# EAGLE design Arduino_Eth08d_MU-REV3 (EAGLE 6.4)
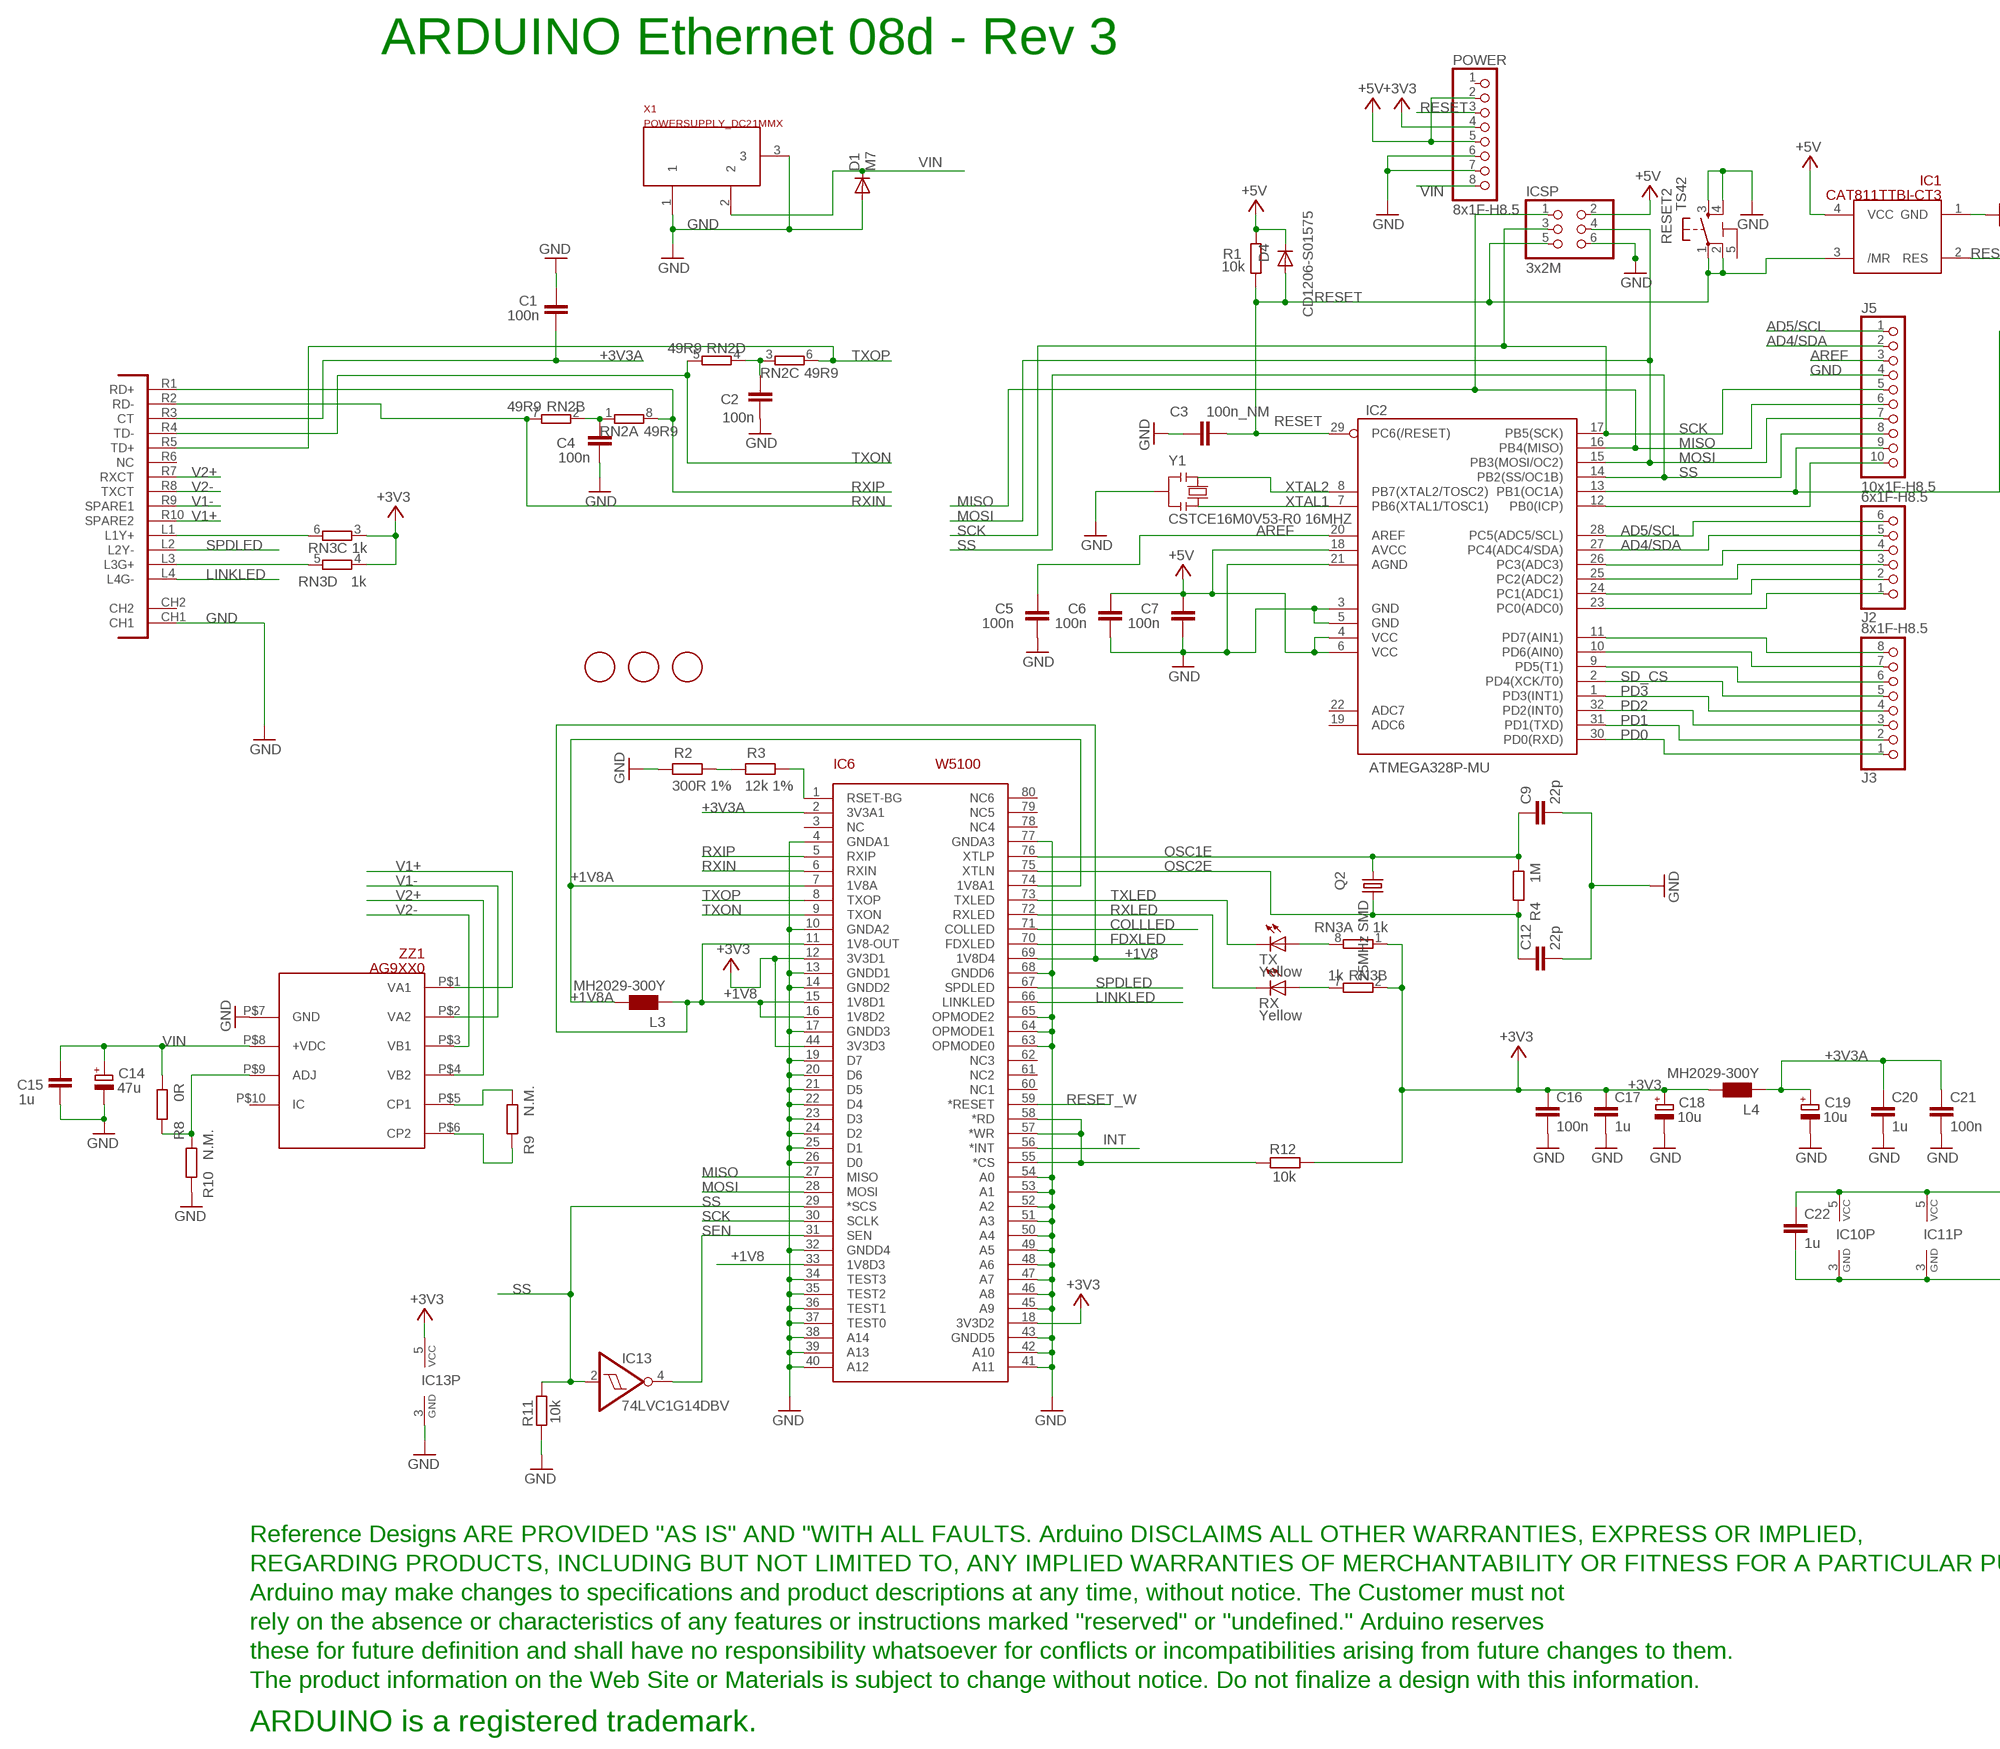
[diagram p0: schematic, sheet 1, part 1 of 2]
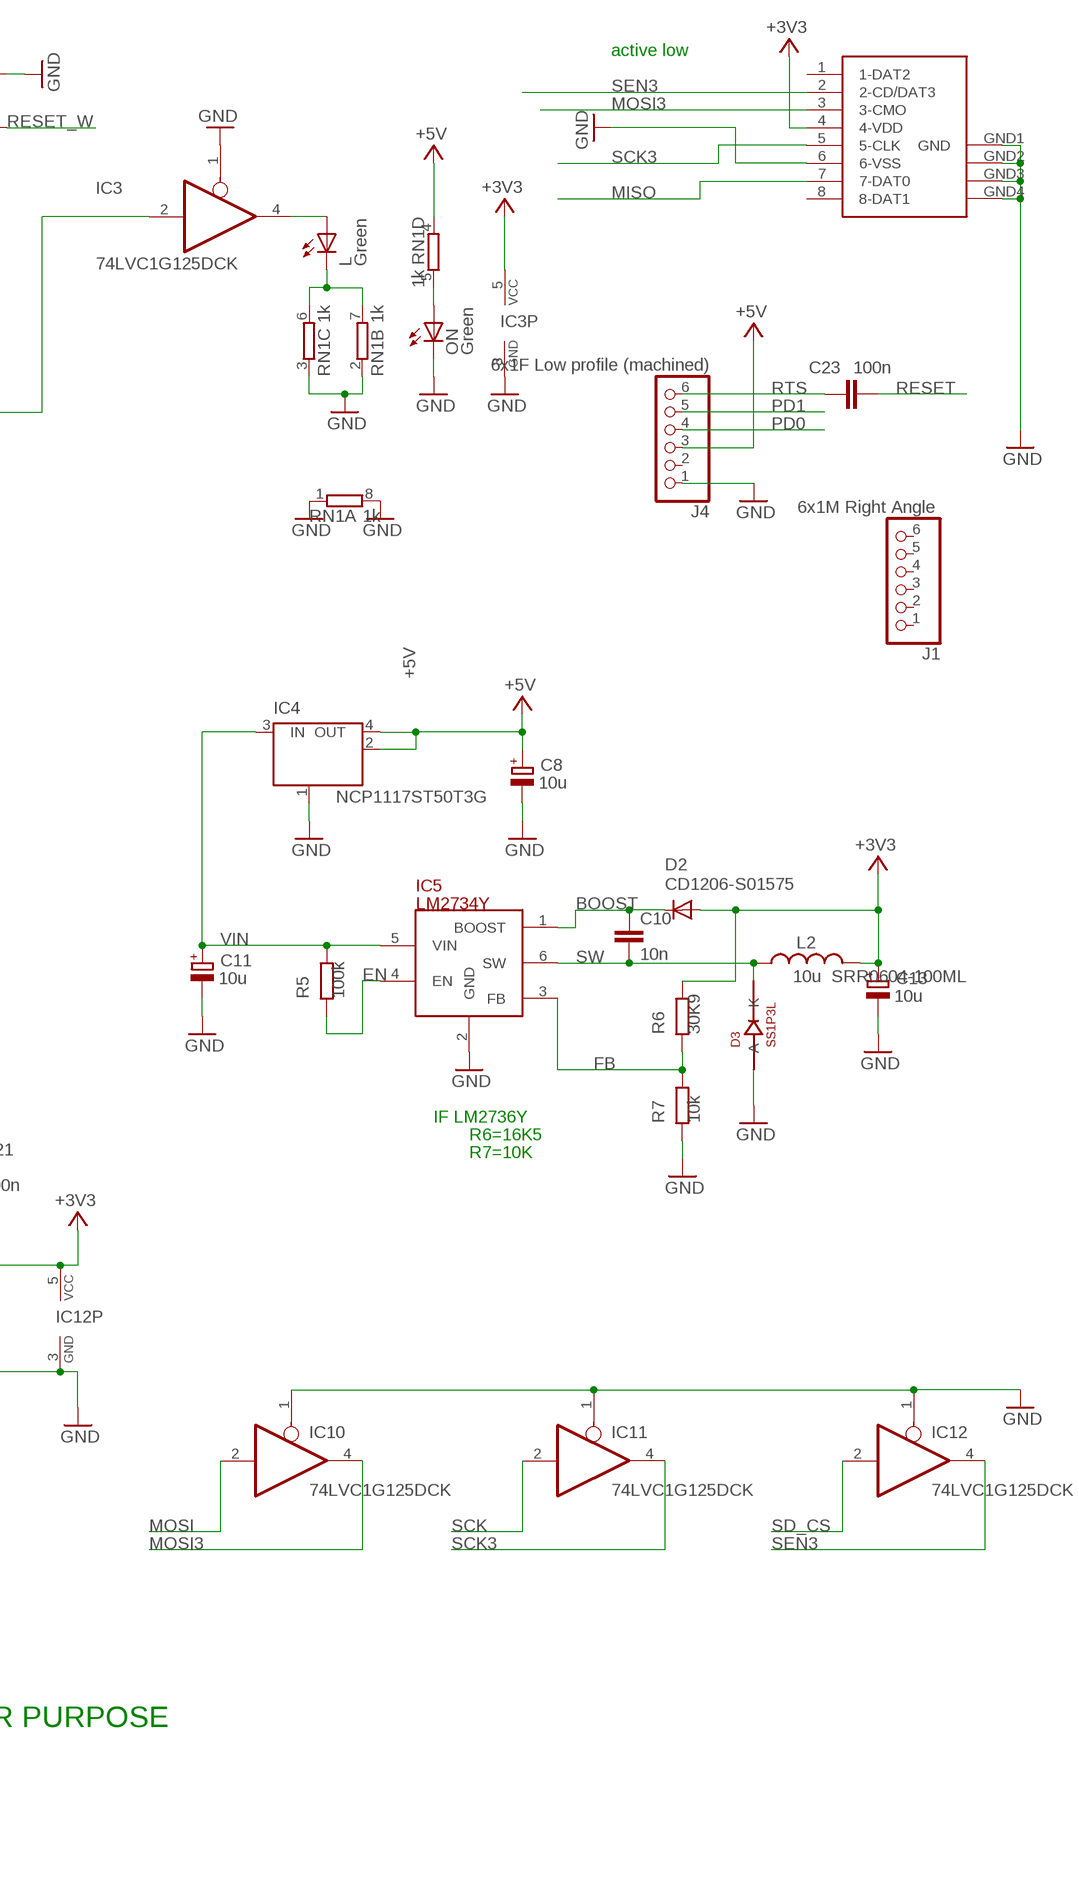
[diagram p1: schematic, sheet 1, part 2 of 2]

## Parts
C1  100n  C-EUC0603  [C0603-ROUND]
C2  100n  C-EUC0603  [C0603-ROUND]
C3  100n_NM  C-EUC0603  [C0603-ROUND]
C4  100n  C-EUC0603  [C0603-ROUND]
C5  100n  C-EUC0603  [C0603-ROUND]
C6  100n  C-EUC0603  [C0603-ROUND]
C7  100n  C-EUC0603  [C0603-ROUND]
C8  10u  CPOL-EUSMCB  [SMC_B]
C9  22p  C-EUC0603  [C0603-ROUND]
C10  10n  C-EUC0603  [C0603-ROUND]
C11  10u  CPOL-EUSMCB  [SMC_B]
C12  22p  C-EUC0603  [C0603-ROUND]
C13  10u  CPOL-EUSMCB  [SMC_B]
C14  47u  CPOL-EUD  [PANASONIC_D]
C15  1u  C-EUC0603  [C0603-ROUND]
C16  100n  C-EUC0603  [C0603-ROUND]
C17  1u  C-EUC0603  [C0603-ROUND]
C18  10u  CPOL-EUSMCB  [SMC_B]
C19  10u  CPOL-EUSMCB  [SMC_B]
C20  1u  C-EUC0603  [C0603-ROUND]
C21  100n  C-EUC0603  [C0603-ROUND]
C22  1u  C-EUC0603  [C0603-ROUND]
C23  100n  C-EUC0603  [C0603-ROUND]
D1  M7  DIODE-SMB  [SMB]
D2  CD1206-S01575  DIODE-MINIMELF  [MINIMELF]
D3  SS1P3L  [DO220AAL]
D4  CD1206-S01575  DIODE-MINIMELF  [MINIMELF]
FD1  FIDUCIALMOUNT  [FIDUCIA-MOUNT]
FD2  FIDUCIALMOUNT  [FIDUCIA-MOUNT]
FD3  FIDUCIALMOUNT  [FIDUCIA-MOUNT]
IC1  CAT811TTBI-CT3  STM812  [SOT143]
IC2  ATMEGA328P-MU  ATMEGAXX8-MUR  [MLF32]
IC3  74LVC1G125DCK  [SC70-5]
IC4  NCP1117ST50T3G  LINEAR_MC33269ST  [LINEAR_SOT223]
IC5  LM2734Y  LM2736Y  [SOT23-6]
IC6  W5100  [SQFP-S-10X10-80]
IC10  74LVC1G125DCK  [SC70-5]
IC11  74LVC1G125DCK  [SC70-5]
IC12  74LVC1G125DCK  [SC70-5]
IC13  74LVC1G14DBV  [SOT23-5]
ICSP  3x2M  PINHD-2X3  [2X03]
J1  6x1M Right Angle  PINHD-1X6/90  [1X06/90]
J2  6x1F-H8.5  PINHD-1X6  [1X06]
J3  8x1F-H8.5  PINHD-1X8  [1X08]
J4  6x1F Low profile (machined)  PINHD-1X6TH  [1X06-TH]
J5  10x1F-H8.5  PINHD-1X10  [1X10]
L  Green  LEDCHIPLED_0805  [CHIPLED_0805]
L2  10u SRR0604-100ML  L-USSRR0604  [SRR0604]
L3  MH2029-300Y  WE-CBF_0805  [0805]
L4  MH2029-300Y  WE-CBF_0805  [0805]
ON  Green  LEDCHIPLED_0805  [CHIPLED_0805]
POWER  8x1F-H8.5  PINHD-1X8  [1X08]
Q2  25MHz SMD  CRYSTALHC49UP  [HC49UP]
R1  10k  R-EU_0603-RND  [R0603-ROUND]
R2  300R 1%  R-EU_0603-RND  [R0603-ROUND]
R3  12k 1%  R-EU_0603-RND  [R0603-ROUND]
R4  1M  R-EU_0603-RND  [R0603-ROUND]
R5  100k  R-EU_0603-RND  [R0603-ROUND]
R6  30K9  R-EU_0603-RND  [R0603-ROUND]
R7  10k  R-EU_0603-RND  [R0603-ROUND]
R8  0R  R-EU_0603-RND  [R0603-ROUND]
R9  N.M.  R-EU_0603-RND  [R0603-ROUND]
R10  N.M.  R-EU_0603-RND  [R0603-ROUND]
R11  10k  R-EU_0603-RND  [R0603-ROUND]
R12  10k  R-EU_R0603  [R0603-ROUND]
RESET2  TS42  [TS42]
RN1  1k  4R-NCAY16  [CAY16]
RN2  49R9  4R-NCAY16  [CAY16]
RN3  1k  4R-NCAY16  [CAY16]
RX  Yellow  LEDCHIPLED_0805  [CHIPLED_0805]
TX  Yellow  LEDCHIPLED_0805  [CHIPLED_0805]
U$1  POE-RJ45  [POE-RJ45]
U$2  DISCLAIMER  [DISCLAIMER]
X1  POWERSUPPLY_DC21MMX  [POWERSUPPLY_DC-21MM]
X2  SDCARD-15TW-8821  [SDCARD-15TW-8821]
Y1  CSTCE16M0V53-R0 16MHZ  RESONATORMU  [RESONATOR]
ZZ1  AG9XX0  [AG9000]

## Nets
+1V8 [power]: IC6.11(1V8-OUT) IC6.15(1V8D1) IC6.16(1V8D2) IC6.33(1V8D3) IC6.69(1V8D4) L3.1
+1V8A [power]: IC6.7(1V8A) IC6.74(1V8A1) L3.2
+3V3 [power]: C13.+ C16.1 C17.1 C18.+ C22.1 D2.A IC3.5(VCC) IC6.12(3V3D1) IC6.18(3V3D2) IC6.44(3V3D3) IC10.5(VCC) IC11.5(VCC) IC12.5(VCC) IC13.5(VCC) L2.P$2 L4.2 POWER.4 R6.1 R12.2 RN3.1 RN3.2 RN3.3 RN3.4 X2.4(4-VDD)
+3V3A [power]: C1.1 C19.+ C20.1 C21.1 IC6.2(3V3A1) L4.1 U$1.R3(CT)
+5V [power]: C6.1 C7.1 C8.+ D4.C IC1.4(VCC) IC2.4(VCC) IC2.6(VCC) IC2.18(AVCC) IC4.2(OUT) IC4.4(OUT) ICSP.2 J4.3 POWER.2 POWER.5 R1.2 RN1.4
AD4/SDA: IC2.27(PC4(ADC4/SDA)) J2.5 J5.2
AD5/SCL: IC2.28(PC5(ADC5/SCL)) J2.6 J5.1
AREF: C5.1 IC2.20(AREF) J5.3
BOOST: C10.1 D2.C IC5.1(BOOST)
COLLLED: IC6.71(COLLED)
EN: IC5.4(EN) R5.2
FB: IC5.3(FB) R6.2 R7.1
FDXLED: IC6.70(FDXLED)
GND [power]: C1.2 C2.1 C3.2 C4.1 C5.2 C6.2 C7.2 C8.- C9.2 C11.- C12.2 C13.- C14.- C15.1 C16.2 C17.2 C18.- C19.- C20.2 C21.2 C22.2 D1.A D3.P$2(A) IC1.1(GND) IC2.3(GND) IC2.5(GND) IC2.21(AGND) IC3.1(OE) IC3.3(GND) IC4.1(GND/ADJ) IC5.2(GND) IC6.4(GNDA1) IC6.10(GNDA2) IC6.13(GNDD1) IC6.14(GNDD2) IC6.17(GNDD3) IC6.19(D7) IC6.20(D6) IC6.21(D5) IC6.22(D4) IC6.23(D3) IC6.24(D2) IC6.25(D1) IC6.26(D0) IC6.32(GNDD4) IC6.34(TEST3) IC6.35(TEST2) IC6.36(TEST1) IC6.37(TEST0) IC6.38(A14) IC6.39(A13) IC6.40(A12) IC6.41(A11) IC6.42(A10) IC6.43(GNDD5) IC6.45(A9) IC6.46(A8) IC6.47(A7) IC6.48(A6) IC6.49(A5) IC6.50(A4) IC6.51(A3) IC6.52(A2) IC6.53(A1) IC6.54(A0) IC6.63(OPMODE0) IC6.64(OPMODE1) IC6.65(OPMODE2) IC6.68(GNDD6) IC6.77(GNDA3) IC10.1(OE) IC10.3(GND) IC11.1(OE) IC11.3(GND) IC12.1(OE) IC12.3(GND) IC13.3(GND) ICSP.6 J4.1 J5.4 ON.C POWER.6 POWER.7 R2.2 R7.2 R10.2 R11.1 RESET2.3 RESET2.4 RN1.1 RN1.2 RN1.3 RN1.8 U$1.CH1 X1.1 X1.3 X2.6(6-VSS) X2.GND1(GND) X2.GND2(GND1) X2.GND3(GND2) X2.GND4(GND3) Y1.2 ZZ1.P$7(GND)
INT: IC6.56(*INT)
LINKLED: IC6.66(LINKLED) U$1.L4(L4G-)
MISO: IC2.16(PB4(MISO)) IC6.27(MISO) ICSP.1 J5.6 X2.7(7-DAT0)
MOSI: IC2.15(PB3(MOSI/OC2)) IC6.28(MOSI) IC10.2(I) ICSP.4 J5.7
MOSI3: IC10.4(O) X2.3(3-CMO)
N$1: IC3.4(O) L.A
N$2: RN3.5 U$1.L3(L3G+)
N$3: RN3.6 U$1.L1(L1Y+)
N$4: IC2.13(PB1(OC1A)) IC3.2(I) J5.9
N$5: L.C RN1.6 RN1.7
N$8: ON.A RN1.5
N$9: RN3.8 TX.A
N$10: C2.2 RN2.3 RN2.4
N$13: IC2.9(PD5(T1)) J3.6
N$14: IC2.10(PD6(AIN0)) J3.7
N$15: IC2.11(PD7(AIN1)) J3.8
N$16: IC2.23(PC0(ADC0)) J2.1
N$17: IC2.24(PC1(ADC1)) J2.2
N$18: IC2.25(PC2(ADC2)) J2.3
N$19: IC2.26(PC3(ADC3)) J2.4
N$22: RN3.7 RX.A
N$29: C4.2 RN2.1 RN2.2
N$30: R2.1 R3.2
N$31: IC6.1(RSET-BG) R3.1
N$32: R9.1 ZZ1.P$5(CP1)
N$33: R9.2 ZZ1.P$6(CP2)
N$34: R8.2 R10.1 ZZ1.P$9(ADJ)
N$36: IC6.55(*CS) IC6.57(*WR) IC6.58(*RD) R12.1
OSC1E: C9.1 IC6.76(XTLP) Q2.1 R4.1
OSC2E: C12.1 IC6.75(XTLN) Q2.2 R4.2
PD0: IC2.30(PD0(RXD)) J3.1 J4.4
PD1: IC2.31(PD1(TXD)) J3.2 J4.5
PD2: IC2.32(PD2(INT0)) J3.3
PD3: IC2.1(PD3(INT1)) J3.4
RESET: C3.1 C23.1 D4.A IC1.3(/MR) IC2.29(PC6(/RESET)) ICSP.5 POWER.3 R1.1 RESET2.1 RESET2.2
RESET_W: IC1.2(RES) IC6.59(*RESET)
RTS: C23.2 J4.6
RXIN: IC6.6(RXIN) RN2.7 U$1.R2(RD-)
RXIP: IC6.5(RXIP) RN2.8 U$1.R1(RD+)
RXLED: IC6.72(RXLED) RX.C
SCK: IC2.17(PB5(SCK)) IC6.30(SCLK) IC11.2(I) ICSP.3 J5.5
SCK3: IC11.4(O) X2.5(5-CLK)
SD_CS: IC2.2(PD4(XCK/T0)) IC12.2(I) J3.5
SEN: IC6.31(SEN) IC13.4(O)
SEN3: IC12.4(O) X2.2(2-CD/DAT3)
SPDLED: IC6.67(SPDLED) U$1.L2(L2Y-)
SS: IC2.14(PB2(SS/OC1B)) IC6.29(*SCS) IC13.2(I) J5.8 R11.2
SW [power]: C10.2 D3.P$1(K) IC5.6(SW) L2.P$1
TXLED: IC6.73(TXLED) TX.C
TXON: IC6.9(TXON) RN2.5 U$1.R4(TD-)
TXOP: IC6.8(TXOP) RN2.6 U$1.R5(TD+)
V1+ [VIN]: U$1.R10(SPARE2) ZZ1.P$1(VA1)
V1- [VIN]: U$1.R9(SPARE1) ZZ1.P$2(VA2)
V2+ [VIN]: U$1.R7(RXCT) ZZ1.P$4(VB2)
V2- [VIN]: U$1.R8(TXCT) ZZ1.P$3(VB1)
VIN [VIN]: C11.+ C14.+ C15.2 D1.C IC4.3(IN) IC5.5(VIN) POWER.8 R5.1 R8.1 X1.2 ZZ1.P$8(+VDC)
WOL/IO: IC2.12(PB0(ICP)) J5.10
XTAL1: IC2.7(PB6(XTAL1/TOSC1)) Y1.3
XTAL2: IC2.8(PB7(XTAL2/TOSC2)) Y1.1
Unconnected: IC2.19(ADC6) IC2.22(ADC7) IC6.3(NC) IC6.60(NC1) IC6.61(NC2) IC6.62(NC3) IC6.78(NC4) IC6.79(NC5) IC6.80(NC6) J1.1 J1.2 J1.3 J1.4 J1.5 J1.6 J4.2 POWER.1 U$1.CH2 U$1.R6(NC) X2.1(1-DAT2) X2.8(8-DAT1) ZZ1.P$10(IC)

## Notes on the sheet
- ARDUINO Ethernet 08d - Rev 3
- active low
- IF LM2736Y
- R6=16K5
- R7=10K

## Power pins joined to a net without a drawn wire
5-GND: RESET2.5(5-GND)

## Library data of the parts
C1-C7 C9 C10 C12 C15-C17 C20-C23 = SmartPrj:C-EU: CAPACITOR, European symbol
C8 C11 C13 C14 C18 C19 = rcl:CPOL-EU: POLARIZED CAPACITOR, European symbol
D1 D2 D4 = diode:DIODE-: DIODE
D3 = SmartPrj:SS1P3L
FD1-FD3 = SmartPrj:FIDUCIALMOUNT
IC1 = SmartPrj:STM812
IC2 = SmartPrj:ATMEGAXX8: MICROCONTROLLER 8 Kbytes FLASH 1 kbytes SRAM 512 bytes EEPROM USART 6-channel 10 bit ADC 2-channel 8 bit ADC Source: avr.lbr
IC3 IC10-IC12 = 74xx-little-us:74*1G125: Single Bus Buffer Gate with 3-State Output
IC4 = SmartPrj:LINEAR_MC33269ST*: Adjustable Output Low Dropout Voltage Regulator 800 mA Source: http://www.onsemi.com/pub/Collateral/MC33269-D.PDF
IC5 = SmartPrj:LM2736Y
IC6 = SmartPrj:W5100
IC13 = 74xx-little-de:74*1G14: Single Schmitt-Trigger Inverter Gate
ICSP = SmartPrj:PINHD-2X3: PIN HEADER
J1 = pinhead:PINHD-1X6: PIN HEADER
J2 J4 = SmartPrj:PINHD-1X6: PIN HEADER
J3 POWER = SmartPrj:PINHD-1X8: PIN HEADER
J5 = SmartPrj:PINHD-1X10: PIN HEADER
L ON RX TX = led:LED: LED OSRAM: - CHIPLED LG R971, LG N971, LY N971, LG Q971, LY Q971, LO R971, LY R971 LH N974, LH R974 LS Q976, LO Q976, LY Q976 LO Q996 - Hyper CHIPLED LW Q18S LB Q993, LB Q99A, LB R99A - SideLED LS A670, LO A670, LY A670, LG A670, LP A670 LB A673, LV A673, LT A673, LW A673 LH A674 LY A675 LS A676, LA A676, LO A676, LY A676, LW A676 LS A679, LY A679, LG A679 - Hyper Micro SIDELED® LS Y876, LA Y876, LO Y876, LY Y876 LT Y87S - SmartLED LW L88C, LW L88S LB L89C, LB L89S, LG L890 LS L89K, LO L89K, LY L89K LS L896, LA L896, LO L896, LY L896 - TOPLED LS T670, LO T670, LY T670, LG T670, LP T670 LSG T670, LSP T670, LSY T670, LOP T670, LYG T670 LG T671, LOG T671, LSG T671 LB T673, LV T673, LT T673, LW T673 LH T674 LS T676, LA T676, LO T676, LY T676, LB T676, LH T676, LSB T676, LW T676 LB T67C, LV T67C, LT T67C, LS T67K, LO T67K, LY T67K, LW E67C LS E67B, LA E67B, LO E67B, LY E67B, LB E67C, LV E67C, LT E67C LW T67C LS T679, LY T679, LG T679 LS T770, LO T770, LY T770, LG T770, LP T770 LB T773, LV T773, LT T773, LW T773 LH T774 LS E675, LA E675, LY E675, LS T675 LS T776, LA T776, LO T776, LY T776, LB T776 LHGB T686 LT T68C, LB T68C - Hyper Mini TOPLED® LB M676 - Mini TOPLED Santana® LG M470 LS M47K, LO M47K, LY M47K Source: http://www.osram.convergy.de LUXEON: - LUMILED® LXK2-PW12-R00, LXK2-PW12-S00, LXK2-PW14-U00, LXK2-PW14-V00 LXK2-PM12-R00, LXK2-PM12-S00, LXK2-PM14-U00 LXK2-PE12-Q00, LXK2-PE12-R00, LXK2-PE12-S00, LXK2-PE14-T00, LXK2-PE14-U00 LXK2-PB12-K00, LXK2-PB12-L00, LXK2-PB12-M00, LXK2-PB14-N00, LXK2-PB14-P00, LXK2-PB14-Q00 LXK2-PR12-L00, LXK2-PR12-M00, LXK2-PR14-Q00, LXK2-PR14-R00 LXK2-PD12-Q00, LXK2-PD12-R00, LXK2-PD12-S00 LXK2-PH12-R00, LXK2-PH12-S00 LXK2-PL12-P00, LXK2-PL12-Q00, LXK2-PL12-R00 Source: www.luxeon.com KINGBRIGHT: KA-3528ASYC Source: www.kingbright.com
L2 = SmartPrj:L-US: INDUCTOR, American symbol
L3 L4 = wuerth-elektronik:WE-CBF: SMD EMI Suppression Ferrite Beads - excellent anti-EMI properties - low DCR - impedances till 3000 ohms - rated current up to 6 A
Q2 = crystal:CRYSTAL: CRYSTAL
R1-R12 = SmartPrj:R-EU_: RESISTOR, European symbol
RESET2 = SmartPrj:TS42: TS42 Dongnan Electronics Tact switch VDC 12V - 50mA
RN1-RN3 = resistor-dil:4R-N: Array Chip Resistor Source: RS Component / Phycomp
U$1 = SmartPrj:POE-RJ45
U$2 = SmartPrj:DISCLAIMER
X1 = SmartPrj:POWERSUPPLY_DC21MM
X2 = st-mod v1.3:SDCARD-15TW-8821: SD Card SDCARD 15TW 8821
Y1 = Nano_MySMD2:RESONATOR
ZZ1 = SmartPrj:AG9XX0: PoE module

## Net classes
0 default: width 0.152 mm, drill 0.61 mm, clearance 0.152 mm
1 power: width 0.152 mm, drill 0.61 mm, clearance 0.152 mm
2 VIN: width 0.61 mm, drill 0.61 mm, clearance 0.254 mm

## Board
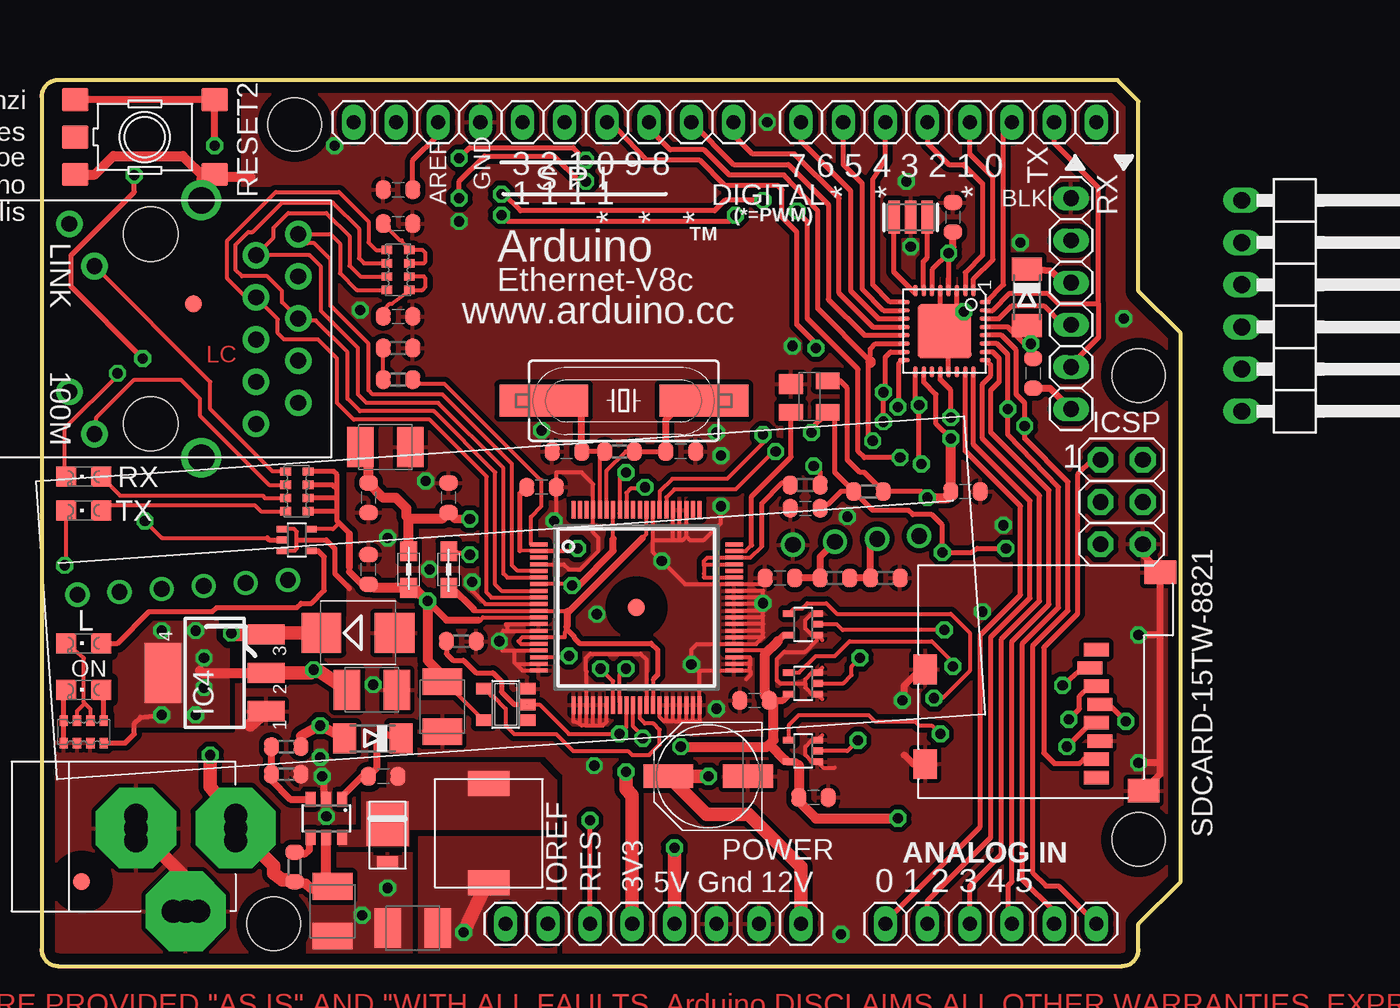
[diagram p2: board, top side]
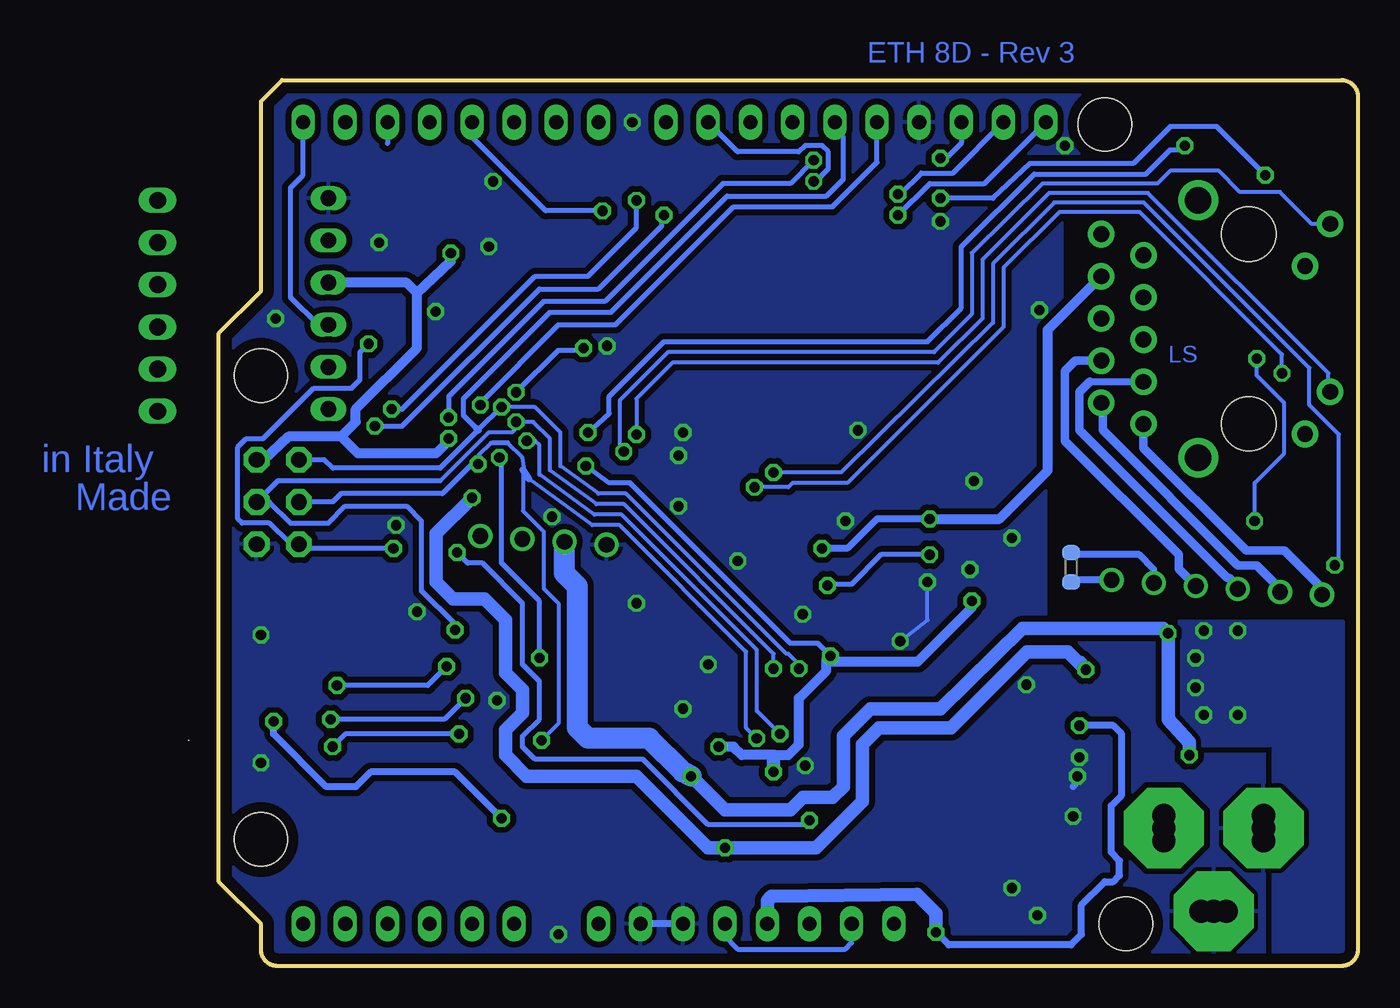
[diagram p3: board, bottom side, seen from below]

Size 68.58 x 53.34 mm. Coordinates in mm from the lower left corner, seen from the top.
Outline: 66.04,2.54 68.58,5.08 68.58,38.1 66.04,40.64 66.04,52.07 64.77,53.34 1,53.34 arc90 0,52.34 0,1 arc90 1,0 65.04,0 arc90 66.04,1 66.04,2.54
Copper layers (1*16): Top 0.035mm / dielectric 1.5mm / Bottom 0.035mm
Design rules "ArduinoETH *": minimum track width 10mil, minimum drill 24mil, track to track 8mil, track to pad 8mil, pad to pad 8mil, via to via 8mil, smd to smd 8mil, copper to edge 25mil, drill to drill 10mil, minimum pad ring 10mil, minimum via ring 8mil, stop-mask expansion 1mil, vias tented up to drill 30mil, thermal gap 10mil
Holes 3.2 mm at 66.04,35.56 66.04,7.62 15.24,50.67 13.97,2.54

### Footprints (pad centres in the part's own frame; a part is rotated, then mirrored left to right if it is on the bottom)
C0603-ROUND = smd 0.898 x 1.1: 1 -0.889,0; 2 0.889,0
SMC_B = smd 1.6 x 2.4: + -1.5,0; - 1.5,0
PANASONIC_D = smd 3 x 1.4: + 2.4,0; - -2.4,0
SMB = smd 2.4 x 2.4: A 2.2,0; C -2.2,0
MINIMELF = smd 1.4 x 1.8: A 1.7,0; C -1.7,0
DO220AAL = smd 2.667 x 2.54: P$1 -0.7,0 | smd 0.762 x 1.27: P$2 1.65,0
FIDUCIA-MOUNT = smd 1.016 x 1.016: P$1 0,0
SOT143 = smd 1.2 x 1.44: 1 -0.75,-1.1 | smd 1 x 1.44: 2 0.95,-1.1; 3 0.95,1.1; 4 -0.95,1.1
MLF32 = smd 0.7 x 0.28: 1 -2.45,1.75; 2 -2.45,1.25; 3 -2.45,0.75; 4 -2.45,0.25; 5 -2.45,-0.25; 6 -2.45,-0.75; 7 -2.45,-1.25; 8 -2.45,-1.75; 17 2.45,-1.75; 18 2.45,-1.25; 19 2.45,-0.75; 20 2.45,-0.25; 21 2.45,0.25; 22 2.45,0.75; 23 2.45,1.25; 24 2.45,1.75 | smd 0.28 x 0.7: 9 -1.75,-2.45; 10 -1.25,-2.45; 11 -0.75,-2.45; 12 -0.25,-2.45; 13 0.25,-2.45; 14 0.75,-2.45; 15 1.25,-2.45; 16 1.75,-2.45; 25 1.75,2.45; 26 1.25,2.45; 27 0.75,2.45; 28 0.25,2.45; 29 -0.25,2.45; 30 -0.75,2.45; 31 -1.25,2.45; 32 -1.75,2.45 | smd 3.254 x 3.254: 33 0,0
SC70-5 = smd 0.4 x 0.7: 1 -0.65,-0.85; 2 0,-0.85; 3 0.65,-0.85; 4 0.65,0.85; 5 -0.65,0.85
LINEAR_SOT223 = smd 1.219 x 2.235: 1 -2.311,-3.099; 2 0,-3.099; 3 2.311,-3.099 | smd 3.6 x 2.2: 4 0,3.099
SOT23-6 = smd 0.6 x 0.9: 1 -0.95,-1.15; 2 0,-1.15; 3 0.95,-1.15; 4 0.95,1.15; 5 0,1.15; 6 -0.95,1.15
SQFP-S-10X10-80 = smd 0.241 x 1.041: 1 -3.8,-5.879; 2 -3.4,-5.879; 3 -3,-5.879; 4 -2.6,-5.879; 5 -2.2,-5.879; 6 -1.8,-5.879; 7 -1.4,-5.879; 8 -1,-5.879; 9 -0.6,-5.879; 10 -0.2,-5.879; 11 0.2,-5.879; 12 0.6,-5.879; 13 1,-5.879; 14 1.4,-5.879; 15 1.8,-5.879; 16 2.2,-5.879; 17 2.6,-5.879; 18 3,-5.879; 19 3.4,-5.879; 20 3.8,-5.879; 41 3.8,5.879; 42 3.4,5.879; 43 3,5.879; 44 2.6,5.879; 45 2.2,5.879; 46 1.8,5.879; 47 1.4,5.879; 48 1,5.879; 49 0.6,5.879; 50 0.2,5.879; 51 -0.2,5.879; 52 -0.6,5.879; 53 -1,5.879; 54 -1.4,5.879; 55 -1.8,5.879; 56 -2.2,5.879; 57 -2.6,5.879; 58 -3,5.879; 59 -3.4,5.879; 60 -3.8,5.879 | smd 1.041 x 0.241: 21 5.879,-3.8; 22 5.879,-3.4; 23 5.879,-3; 24 5.879,-2.6; 25 5.879,-2.2; 26 5.879,-1.8; 27 5.879,-1.4; 28 5.879,-1; 29 5.879,-0.6; 30 5.879,-0.2; 31 5.879,0.2; 32 5.879,0.6; 33 5.879,1; 34 5.879,1.4; 35 5.879,1.8; 36 5.879,2.2; 37 5.879,2.6; 38 5.879,3; 39 5.879,3.4; 40 5.879,3.8; 61 -5.879,3.8; 62 -5.879,3.4; 63 -5.879,3; 64 -5.879,2.6; 65 -5.879,2.2; 66 -5.879,1.8; 67 -5.879,1.4; 68 -5.879,1; 69 -5.879,0.6; 70 -5.879,0.2; 71 -5.879,-0.2; 72 -5.879,-0.6; 73 -5.879,-1; 74 -5.879,-1.4; 75 -5.879,-1.8; 76 -5.879,-2.2; 77 -5.879,-2.6; 78 -5.879,-3; 79 -5.879,-3.4; 80 -5.879,-3.8
SOT23-5 = smd 0.69 x 0.99: 1 -0.95,-1.29; 2 0,-1.29; 3 0.95,-1.29; 4 0.95,1.3; 5 -0.95,1.3
2X03 = drill 0.95 pad 1.55 octagon: 1 -2.54,-1.27; 2 -2.54,1.27; 3 0,-1.27; 4 0,1.27; 5 2.54,-1.27; 6 2.54,1.27
1X06/90 = drill 1.016 long: 1 -6.35,-3.81; 2 -3.81,-3.81; 3 -1.27,-3.81; 4 1.27,-3.81; 5 3.81,-3.81; 6 6.35,-3.81
1X06 = drill 0.85 pad 1.422 long: 1 -6.35,0; 2 -3.81,0; 3 -1.27,0; 4 1.27,0; 5 3.81,0; 6 6.35,0
1X08 = drill 0.85 pad 1.422 long: 1 -8.89,0; 2 -6.35,0; 3 -3.81,0; 4 -1.27,0; 5 1.27,0; 6 3.81,0; 7 6.35,0; 8 8.89,0
1X06-TH = drill 0.95 pad 1.422 long: 1 -6.35,0; 2 -3.81,0; 3 -1.27,0; 4 1.27,0; 5 3.81,0; 6 6.35,0
1X10 = drill 0.85 pad 1.422 long: 1 -11.43,0; 2 -8.89,0; 3 -6.35,0; 4 -3.81,0; 5 -1.27,0; 6 1.27,0; 7 3.81,0; 8 6.35,0; 9 8.89,0; 10 11.43,0
CHIPLED_0805 = smd 1.2 x 1.2: A 0,-1.05; C 0,1.05
SRR0604 = smd 1.5 x 2.5: P$1 3,0; P$2 -3,0
0805 = smd 1.2 x 1: 1 -1.1,0; 2 1.1,0
HC49UP = smd 5.334 x 1.93: 1 -4.826,0; 2 4.826,0
R0603-ROUND = smd 0.898 x 1.1: 1 -0.889,0; 2 0.889,0
TS42 = smd 1.6 x 1.4: 1 -4.2,2.25; 2 4.2,2.25; 3 -4.2,-2.25; 4 4.2,-2.25; 5 -4.2,0
CAY16 = smd 0.5 x 0.65: 1 -1.2,-0.675; 2 -0.4,-0.675; 3 0.4,-0.675; 4 1.2,-0.675; 5 1.2,0.675; 6 0.4,0.675; 7 -0.4,0.675; 8 -1.2,0.675
POE-RJ45 = drill 1.6: CH1 13.94,7.75; CH2 13.94,-7.75 | drill 0.95 pad 1.6: L1 7.51,-6.325; L2 5.99,-3.785; L3 7.51,3.785; L4 5.99,6.325; R1 19.77,5.715; R2 17.23,4.445; R3 19.77,3.175; R4 17.23,1.905; R5 19.77,0.635; R6 17.23,-0.635; R7 19.77,-1.905; R8 17.23,-3.175; R9 19.77,-4.445; R10 17.23,-5.715 | hole 3.25: 10.89,5.715; 10.89,-5.715
POWERSUPPLY_DC-21MM = drill 1.4 pad 4.826 octagon: 1 -5.08,-3.353; 2 -0.076,-6.35; 3 -0.076,-0.356 | drill 1.4: 4 -5.08,-4.115; 5 -5.08,-2.591; 6 -0.838,-0.356; 7 0.686,-0.356; 8 -0.838,-6.35; 9 0.686,-6.35
SDCARD-15TW-8821 = smd 0.8 x 1.5: 1 0,0; 2 1.1,-0.4; 3 2.2,0; 4 3.3,0.2; 5 4.4,0; 6 5.5,0.2; 7 6.6,0; 8 7.7,0 | smd 1.4 x 1.9: GND1 -4.66,3.85; GND2 8.49,2.85 | smd 1.8 x 1.4: GND3 1.19,-10.3; GND4 6.89,-10.3
RESONATOR = smd 0.7 x 2: 1 -1,0; 2 0,0; 3 1,0
AG9000 = drill 0.95 pad 1.422: P$1 0,0; P$2 2.54,0; P$3 5.08,0; P$4 7.62,0; P$5 10.16,0; P$6 12.7,0; P$7 43.18,0; P$8 45.72,0; P$9 48.26,0; P$10 50.8,0

### Placement (x,y rotation side)
C1  30.1,28.83 0 top
C2  21.46,44.7 180 top
C3  45.97,27.56 180 top
C4  21.46,39.12 180 top
C5  21.46,46.74 180 top
C6  55.63,28.57 0 top
C7  54.86,45.09 90 top
C8  19.89,16.64 0 top
C9  31.62,30.99 180 top
C10  20.57,11.43 0 top
C11  17.53,3.3 270 top
C12  38.48,30.99 0 top
C13  24.13,15.62 270 top
C14  40.13,11.43 180 top
C15  44.45,23.37 0 top
C16  42.93,16 180 top
C17  19.68,23.88 90 top
C18  22.35,2.29 180 top
C19  20.7,31.24 0 top
C20  19.68,28.19 270 top
C21  24.51,28.19 90 top
C22  46.48,10.16 0 top
C23  59.69,35.69 270 top
D1  19.05,20.07 0 top
D2  19.94,13.72 180 top
D3  20.83,7.87 270 top
D4  59.31,40.26 270 top
FD1  9.14,39.88 0 top
FD2  35.81,21.59 0 top
FD3  2.41,5.08 0 top
IC1  46.23,34.29 270 top
IC2  54.36,38.23 270 top
IC3  15.37,25.65 270 top
IC4  10.41,17.65 90 top
IC5  17.14,8.89 180 top
IC6  35.81,21.59 270 top
IC10  45.85,20.57 90 top
IC11  45.85,12.95 90 top
IC12  45.85,17.02 90 top
IC13  27.94,15.75 90 top
ICSP  65.02,27.94 270 top
J1  76.07,39.75 270 top  (outside the outline)
J2  57.15,2.54 0 top
J3  54.61,50.8 180 top
J4  61.98,39.88 270 top
J5  30.23,50.8 0 top
L  2.54,19.43 90 top
L2  26.92,8 90 top
L3  24.51,23.88 90 top
L4  22.1,23.88 270 top
ON  2.54,16.64 90 top
POWER  36.83,2.54 0 top
Q2  35.05,34.04 0 top
R1  49.78,28.57 0 top
R2  21.46,37.21 0 top
R3  21.46,35.31 180 top
R4  34.8,30.99 0 top
R5  15.24,5.97 90 top
R6  14.73,13.21 180 top
R7  14.73,11.56 0 top
R8  47.75,23.37 0 top
R9  17.27,24 270 bottom
R10  50.8,23.37 0 top
R11  25.27,19.56 180 top
R12  45.97,28.96 0 top
RESET2  6.22,49.91 0 top
RN1  2.54,14.1 0 top
RN2  21.46,41.91 90 top
RN3  15.37,28.57 90 top
RX  2.54,29.46 90 top
TX  2.54,27.43 90 top
U$1  -4.32,38.35 0 top
U$2  -19.43,-21.08 0 top  (outside the outline)
X1  5.33,8.38 90 top
X2  63.5,19.05 270 top
Y1  52.32,45.09 0 top
ZZ1  2.16,22.35 4 top

### Tracks (layer width: path | path; a pad name or v marks a point on that pad's centre or on a via)
+1V8
  Top 0.254: 31.62,20.45 31.59,20.3 31.5,20.07 31.5,19.79 IC6.15 28.93,19.79 28.7,19.56 28.87,19.39 IC6.16 | 36.81,17.26 IC6.33 | 26.04,21.46 26.11,21.39 IC6.11 31.7,21.39 31.75,21.34 | IC6.69 36.41,26 36.16,25.75
  Top 0.305: 31.59,20.3 32.08,19.81 32.08,19.73 32.38,19.43 36.7,19.43 37.08,19.05 37.08,17.53 36.81,17.26
  Top 0.406: 31.62,20.45 31.62,21.34 31.75,21.34 36.16,25.75 | 26.04,21.46 24.64,22.86 24.55,22.86 L3.1
+1V8A  (via drill 0.61)
  Top 0.254: IC6.7 31.62,22.99 31.88,22.99 | 34.41,25.74 IC6.74
  Top 0.305: L3.2 v25.78,24.77
  Top 0.406: 31.88,22.99 v31.94,22.92 32.35,22.92 34.41,24.99 34.41,25.74
  Bottom 0.305: v25.78,24.77 28.7,24.77 30.48,22.99 31.37,22.99 v31.94,22.92
+3V3  (via drill 0.61)
  Top 0.254: IC6.18 31.57,18.59 v31.75,18.67 | IC6.12 26.58,20.99 26.42,20.83 | IC13.5 26.6,14.8 24.64,16.76 24.38,16.74 C13.+ | IC6.44 43.63,18.99 43.56,18.8 | 44.18,14.34 44.18,14.37 44.13,14.41 | IC3.5 17.54,26.3 17.91,26.67
  Top 0.305: v46.48,30.1 46.86,29.72 R12.2 | 44.07,14.22 44.18,14.34 | 44.32,19.56 44.39,19.62 | C16.1 43.88,16.07 | X2.4 64.26,15.75 v65.28,14.73 | 18.53,23.74 18.54,24 | RN3.3 17.51,28.98 17.78,28.7 | 17.78,27.43 17.78,26.8 17.91,26.67 18.54,26.04 | 17.78,27.43 17.78,28.07 | 17.78,28.07 17.78,28.7 | RN3.1 17.72,27.38 17.78,27.43 | RN3.2 17.67,28.18 17.78,28.07 | RN3.4 17.6,29.77 17.78,29.59 17.78,28.7 | 26.29,20.83 26.42,20.83
  Top 0.406: L4.2 21.93,22.9 | 44.07,16 C16.1 44.63,16 IC12.5 | 44.39,19.62 44.69,19.92 IC10.5 | 18.54,24 18.54,26.04 | C17.1 19.41,22.86 18.53,23.74 | 26.29,20.83 24.38,20.83 v23.24,21.97 | 44.77,12.38 44.85,12.3 IC11.5 45.39,12.3 45.59,12.1
  Top 0.61: C13.+ 24.36,17.3 23.24,18.41 v23.24,21.97 22.56,22.65 L4.2 20.02,22.78 C17.1 | v51.56,8.89 46.61,8.89 45.59,9.91 C22.1 45.59,12.1 | 44.32,19.56 43.56,18.8 43.56,16.26 C16.1 | v38.48,13.21 43.69,13.21 43.81,13.34 | 44.07,16 44.07,14.22 44.07,13.59 43.81,13.34 | 43.81,13.34 44.77,12.38 | R6.1 15.62,13.84 v16.76,14.48 D2.A
  Top 0.813: v25.4,2.03 26.67,4.7 | POWER.4 35.56,10.29 35.18,10.67 v35.18,11.68
  Bottom 0.305: v31.75,18.67 32.51,19.43 34.16,19.43 43.81,29.08 45.09,29.08 v46.48,30.1
  Bottom 0.406: v16.76,14.48 14.73,14.48 14.22,13.97 14.22,10.29 14.86,9.65 14.86,6.86 14.35,6.35 14.35,5.46 14.73,5.08 15.24,5.08 16.64,3.68 16.64,1.91 17.27,1.27 24.64,1.27 v25.4,2.03 | v65.28,14.73 65.28,13.97 62.1,10.79 60.33,10.79 59.44,11.68 54.36,11.68 v51.56,8.89
  Bottom 0.61: 35.05,12.7 37.08,12.7 37.59,13.21 v38.48,13.21 | 35.05,12.7 34.29,12.7 33.66,13.34 33.66,16.13 32,17.78 32,18.41 v31.75,18.67 31.67,18.34 26.5,18.34 23.24,21.59 v23.24,21.97 | 35.18,12.57 35.05,12.7
  Bottom 0.813: v25.4,2.03 25.4,3.17 26.54,4.32 35.31,4.19 35.56,3.94 POWER.4 | v35.18,11.68 35.18,12.57
  pour Top (isolate 0.406, no thermals): 30.99,7.75 22.73,7.75 22.73,0.51 30.99,0.51
+3V3A  (via drill 0.61)
  Top 0.254: 28.8,25.02 31.4,24.99 IC6.2 32.5,24.99 32.16,24.99 32.18,25.02
  Top 0.305: 28.8,25.02 28.8,28.47 C1.1
  Top 0.406: v32.26,25.15 32.18,25.02
  Top 0.508: v25.78,26.92 24.89,26.92 C21.1
  Top 0.61: L4.1 22.1,26.95 | 22.1,26.95 24.15,26.95 C21.1 | C19.+ 19.68,30.76 C20.1 20.57,28.19 21.34,28.19 21.97,27.56 21.97,27.07 22.1,26.95
  Bottom 0.406: v32.26,25.15 30.73,25.15 28.96,26.92 v25.78,26.92
  Bottom 0.61: U$1.R3 18.67,38.31 18.67,29.84 21.59,26.92 v25.78,26.92
+5V  (via drill 0.61, 0.61 pad 1.02)
  Top 0.305: IC1.4 48.07,35.24 48.51,34.8 48.51,30.48 49.28,29.72 49.53,29.72 R1.2 52.96,28.57 v53.34,28.19 53.34,28.32 | 54.61,41.41 IC2.4 54.61,42.67 v54.61,42.93 53.61,41.92 IC2.6 | v7.24,15.11 5.97,14.99 5.59,14.61 5.59,13.97 5.04,13.42 RN1.4 | IC2.18 53.11,35.16 53.85,34.42 53.85,32.64 v54.74,31.75
  Top 0.406: C7.1 54.86,43.31 v54.61,42.93 | 54.61,28.19 C6.1 | D4.C 60.78,41.83 61.47,41.15 J4.3
  Top 0.61: IC4.2 9.65,17.65 9.53,17.78 | C6.1 v54.74,31.75 | v53.34,28.19 54.61,28.19
  Top 0.813: v38.1,7.11 POWER.5 | C8.+ 16.64,17.81 v16.39,17.84 16.2,17.65 IC4.2
  Bottom 0.305: POWER.2 30.48,1.4 30.86,1.02 37.34,1.02 38.23,1.91 38.23,2.41 POWER.5
  Bottom 0.61: v54.74,31.75 54.74,31.62 55.5,30.86 60.2,30.86 61.21,31.88 | 61.21,31.88 64.39,31.88 65.91,30.48 ICSP.2 | J4.3 57.28,41.15 56.64,40.51 | 56.64,40.51 56.64,37.21 60.33,33.53 60.33,32.77 61.21,31.88 | 56.64,40.51 54.61,42.42 v54.61,42.93
  Bottom 0.813: 16.71,18.29 v16.39,17.84 17.47,18.92 19.94,18.92 24.51,14.35 28.83,14.35 29.84,13.34 29.84,9.91 32.64,7.11 v38.1,7.11 39.12,7.11 43.43,11.43 50.04,11.43 51.31,12.7 51.31,14.22 50.29,15.24 50.29,16.64 51.31,17.65 51.31,20.83 52.58,22.1 54.48,22.1 55.5,23.11 55.5,26.04 v53.34,28.19
  other vias: 9.27,20.19 7.24,20.19 9.27,15.11 9.78,18.54 9.78,16.76
  pour Top (isolate 0.406, no thermals): 4.45,20.95 11.18,21.08 11.18,14.48 4.45,14.48
  pour Bottom (isolate 0.305, no thermals): 0.89,20.7 10.92,20.7 10.92,13.34 5.08,13.34 5.08,-0.64 0.64,-0.64
AD4/SDA  (via drill 0.61)
  Top 0.305: J2.5 60.96,3.3 59.05,5.21 59.05,19.43 61.21,21.59 61.21,28.83 58.17,32 v58.17,33.53 58.17,36.83 57.52,37.48 IC2.27 | v43.43,46.1 41.15,46.1 40.51,45.47 28.83,45.47 27.81,46.48 v27.69,46.48
  Bottom 0.305: v43.43,46.1 43.43,44.45 46.35,41.53 49.53,41.53 57.53,33.53 v58.17,33.53 | v27.69,46.48 27.56,46.48 26.29,47.75 24.38,47.75 J5.2
AD5/SCL  (via drill 0.61)
  Top 0.305: J2.6 61.21,4.83 60.45,4.83 59.69,5.59 59.69,19.3 61.78,21.4 61.78,29.15 59.18,31.75 v59.18,32.51 59.18,33.91 58.67,34.42 58.67,37.08 57.78,37.98 IC2.28 | v27.69,45.21 28.07,44.83 41.4,44.83 v41.78,45.21
  Bottom 0.305: v59.18,32.51 57.53,32.51 49.28,40.77 45.72,40.77 41.91,44.58 41.91,45.09 v41.78,45.21 | v27.69,45.21 25.78,47.12 22.48,47.12 J5.1
AREF  (via drill 0.61, 0.61 pad 1.02)
  Top 0.305: IC2.20 54.11,35.3 54.74,34.67 v54.74,33.02 | v25.15,48.64 25.78,49.28 32,49.28 v32.77,48.51 | C5.1 22.35,48.51 23.88,50.04 J5.3
  Bottom 0.305: v32.77,48.51 34.16,47.12 38.23,47.12 45.34,40.01 49.02,40.01 54.74,34.29 v54.74,33.02 | v25.15,48.64 24.77,48.64 23.88,49.53 J5.3
BOOST
  Top 0.305: 18.09,10.09 18.16,10.16 18.16,10.29
  Top 0.406: D2.C 20.7,13.97 20.19,13.46 20.19,11.94 C10.1 19.56,11.68 18.16,10.29 | IC5.1 18.09,10.09
EN
  Top 0.406: R5.2 15.82,6.73 16.13,6.99 16.13,7.67 IC5.4
FB
  Top 0.406: R6.2 R7.1 13.84,11.18 14.98,10.04 IC5.3
GND  (via drill 0.61)
  Top 0.254: IC6.4 31.44,24.19 31.75,23.88 32.41,23.88 33.53,24.99 33.53,25.78 33.21,26.09 IC6.77 33.21,29.02 32.51,29.72 30.99,29.72 C1.2 30.99,26.92 v30.86,26.8 | 28.45,18.99 27.75,18.99 v27.56,19.56 27.81,20.19 28.06,20.19 | 28.45,18.99 IC6.17 | IC6.13 27.96,20.59 27.94,20.57 28.06,20.45 28.06,20.19 | 28.06,20.19 IC6.14 | 28.55,18.19 IC6.19 | 28.55,18.19 28.45,18.29 28.45,18.99 | IC6.20 28.95,17.79 28.55,18.19 | IC6.26 34.01,14.71 33.78,14.48 33.53,14.48 | 32.77,14.48 32.51,14.48 32.41,14.58 | 32.77,14.48 33.27,14.48 | 33.27,14.48 33.53,14.48 | IC6.21 32.01,14.72 32.41,14.58 | 32.41,14.58 IC6.22 | 32.77,14.48 32.81,14.53 IC6.23 32.81,17.73 32.77,17.78 32.77,18.54 33.02,18.8 36.07,18.8 36.41,18.45 IC6.32 | IC6.24 33.21,14.54 33.27,14.48 | IC6.25 33.61,14.56 33.53,14.48 | v39.12,18.16 39.61,17.66 IC6.40 39.62,15.98 39.62,14.73 39.12,14.73 | 37.59,14.73 37.47,14.73 37.21,14.99 IC6.34 | 38.1,14.73 37.59,14.73 | 38.1,14.73 38.35,14.73 | 38.35,14.73 38.86,14.73 | 38.86,14.73 39.12,14.73 | IC6.35 37.61,14.75 37.59,14.73 | IC6.36 38.01,14.82 38.1,14.73 | IC6.37 38.41,14.79 38.35,14.73 | IC6.38 38.81,14.78 38.86,14.73 | IC6.39 39.21,14.83 39.12,14.73 | 42.66,17.79 IC6.41 39.49,17.79 v39.12,18.16 | 42.66,17.79 42.67,17.78 42.67,17.53 42.42,17.27 | 42.66,17.79 42.67,18.29 | 42.67,18.29 42.67,18.54 42.62,18.59 IC6.43 | IC6.42 42.57,18.19 42.67,18.29 | 43.3,22.99 IC6.54 38.73,22.99 v37.34,24.38 36.81,24.91 36.81,25.65 | v43.43,21.84 43.43,22.61 43.42,22.59 IC6.53 | 43.43,20.07 43.43,19.81 43.41,19.79 | 43.41,19.79 43.01,19.39 IC6.45 39.46,19.39 39.12,19.05 v39.12,18.16 | 43.43,20.07 43.43,20.57 | 43.43,20.57 43.43,21.08
  Top 0.254: 43.43,21.08 43.43,21.34 | 43.43,21.34 v43.43,21.84 | IC6.52 43.34,22.19 v43.43,21.84 | IC6.51 43.38,21.79 v43.43,21.84 | IC6.50 43.38,21.39 43.43,21.34 | IC6.49 43.34,20.99 43.43,21.08 | IC6.48 43.42,20.59 43.43,20.57 | IC6.47 43.31,20.19 43.43,20.07 | 43.41,19.79 IC6.46 | 36.81,25.65 IC6.68 | 38.81,25.86 IC6.63 | 38.81,25.86 38.61,25.65 38.35,25.65 | 36.81,25.65 38.1,25.65 | 38.1,25.65 38.35,25.65 | IC6.64 38.41,25.71 38.35,25.65 | IC6.65 38.01,25.74 38.1,25.65 | v40.89,27.69 40.89,26.67 39.88,25.65 39.02,25.65 38.81,25.86 | IC6.10 26.72,21.79 25.91,22.61 v25.91,23.11 | 47,19.62 IC10.1 46.37,19.92 45.97,20.32 45.97,20.83 46.37,21.22 IC10.3 | 47,17.97 IC12.3 46.37,17.67 45.97,17.27 45.97,17.02 | 47,16.07 IC12.1 46.37,16.37 45.97,16.76 45.97,17.02 | 47,13.9 IC11.3 46.37,13.6 45.97,13.21 45.97,12.7 46.37,12.3 IC11.1 47.06,11.94 47.75,11.94 | 46.67,19.62 45.97,18.92 44.7,18.92 44.27,18.49 44.27,17.2 44.45,17.02 45.97,17.02 | IC3.1 15.22,26.3 15.37,26.16 15.37,25.65 15.37,25.15 15.24,25.02 14.53,25.02 IC3.3
  Top 0.305: 18.54,22.73 17.65,23.62 17.65,25.15 17.14,25.65 15.37,25.65 | RN1.1 RN1.8 1.34,16.49 ON.C | IC2.21 54.61,38.45 v55.52,39.4 | IC2.3 55.11,39.28 v55.52,39.4 | IC2.5 54.1,40.57 54.1,39.24 54.23,39.12 v55.52,39.4
  Top 0.406: X1.3 5.69,8.48 | IC5.2 17.02,10.17 17.02,11.3 v16.89,11.43 | C11.- 17.8,1.68 | ICSP.6 66.29,24.77 X2.GND1 67.35,20.07 | 67.35,12.19 67.35,11.56 X2.GND2 | 67.35,12.19 67.35,20.07 | v66.04,19.94 67.22,19.94 67.35,20.07 | v66.04,12.24 67.3,12.24 67.35,12.19 | X2.GND3 52.91,17.86 51.94,16.89 51.94,16.13 v51.82,16 51.94,15.88 | X2.GND4 52.48,12.16 51.94,12.7
  Top 0.61: RESET2.3 3.21,47.66 4.32,48.77 8.51,48.77 9.78,47.5 9.78,47.53 | 9.78,47.53 RESET2.4 | U$1.CH1 9.62,47.38 9.78,47.53 | 9.78,47.53 12.54,47.53 12.57,47.5
  Top 0.813: X1.1 8.69,5.31 X1.3 5.71,8.33 | 12.57,14.53 IC4.1
  Bottom 0.254: v25.91,23.11 25.91,20.83 v27.56,19.56
  Bottom 0.406: POWER.6 POWER.7 | v16.89,11.43 17.14,10.79
  other vias: 23.11,29.21 19.3,3.05 20.83,4.7 16.76,12.57 17.14,9.02 33.43,21.18 40.64,15.49 33.27,12.06 19.96,16.94 57.91,26.54 43.69,50.8 40.89,30.73 48.13,1.91 20.83,25.78 19.18,39.5 25.15,44.83 17.65,49.4 30.1,32.26 45.21,37.34 48.51,27.05 52.32,43.31 40.64,32.13 56.64,21.34 65.15,38.99 58.93,43.56 23.37,23.88 52.07,47.24
  pour Bottom (isolate 0.406, no thermals): 14.48,15.24 23.24,15.24 24.51,13.97 24.51,13.72 30.48,13.59 30.48,3.94 26.67,3.94 26.67,0.76 14.48,0.76
  pour Top (isolate 0.406, rank 2, no thermals): 16,3.3 18.8,3.3 19.3,3.81 19.3,6.6 22.1,6.6 22.1,0.51 16,0.51
  pour Top (isolate 0.305, no thermals): 15.75,8.51 15.75,9.27 16.89,9.27 16.89,10.92 15.68,10.92 15.11,11.49 15.11,12.95 15.24,13.08 17.4,13.08 18.03,12.45 18.03,11.37 17.59,10.92 17.4,10.92 17.4,9.27 18.54,9.27 18.54,8.51
  pour Top (isolate 0.305, rank 3): 0.51,13.46 4.45,13.46 4.45,20.95 18.41,20.95 18.41,37.34 17.27,37.34 17.27,46.99 12.06,46.99 12.06,53.47 64.26,52.83 65.53,51.56 65.53,40.13 68.07,37.59 68.07,5.59 65.53,3.05 65.53,1.51 arc-90 64.53,0.51 1.51,0.51 arc-90 0.51,1.51
  pour Bottom (isolate 0.356, rank 2): 17.78,46.99 12.06,46.99 12.06,52.83 64.26,52.83 65.53,51.56 65.53,40.13 68.07,37.59 68.07,5.59 65.53,3.05 65.53,1.51 arc-90 64.53,0.51 1.51,0.51 0.51,1.51 0.76,20.83 18.8,20.7 18.8,37.34 17.78,37.47
LINKLED  (via drill 0.61)
  Top 0.254: IC6.66 37.61,28.22 38.1,28.7 41.78,28.7 44.07,30.99 v44.2,30.99
  Bottom 0.254: v44.2,30.99 44.45,31.24 44.45,34.04 41.53,36.96 25.53,36.96 23.24,39.24 23.24,42.93 18.99,47.12 12.06,47.12 11.3,47.88 8.38,47.88 7.11,46.61 4.7,46.61 2.77,44.68 U$1.L4
MISO  (via drill 0.61)
  Top 0.254: IC6.27 34.41,17.14 v33.66,17.91
  Top 0.305: ICSP.1 63.25,30.48 62.36,29.59 62.36,21.21 60.33,19.18 60.33,12.83 60.96,12.19 62.48,12.19 62.74,12.45 X2.7 | IC2.16 51.8,36.48 51.61,36.27 51.61,33.74 v51.56,33.66
  Bottom 0.254: v33.66,17.91 33.66,18.16 34.29,18.8 34.42,18.8 44.07,28.45 45.72,28.45 48.01,30.1 48.01,32.13 49.53,33.66 v51.56,33.66
  Bottom 0.305: J5.6 31.5,50.42 30.99,49.91 30.99,47.37 32,46.35 37.97,46.35 44.96,39.37 48.64,39.37 53.85,34.16 53.85,33.15 53.09,32.38 | ICSP.1 62.23,30.48 61.72,29.97 55.24,29.97 52.96,32.26 v51.56,33.66
  Bottom 0.406: 52.96,32.26 53.09,32.38
MOSI  (via drill 0.61)
  Top 0.254: v35.18,17.91 34.8,17.53 34.8,16.01 IC6.28 | IC10.2 47.88,20.57 48.22,20.23 v54.36,20.23
  Top 0.305: J5.7 34.04,51.05 36.45,48.51 39.62,48.51 41.15,46.99 44.32,46.99 44.58,46.74 44.58,45.09 45.47,44.2 45.47,38.61 46.61,37.47 v46.61,37.21 | v54.36,20.23 54.36,20.32 | IC2.15 51.12,36.98 50.8,36.66 50.8,34.67 v50.67,34.54 v50.67,32.77
  Bottom 0.254: v35.18,17.91 35.18,18.8 44.2,27.81 45.85,27.81 48.64,29.84 48.64,31.75 49.66,32.77 v50.67,32.77 50.8,32.26 50.93,32.13 52.32,32.13 55.24,29.21
  Bottom 0.305: v54.36,20.23 54.4,20.61 56.39,22.61 56.39,26.8 57.28,27.69 60.96,27.69 61.98,26.67 64.26,26.67 65.53,27.94 ICSP.4 65.02,29.21 55.24,29.21 | v46.61,37.21 46.74,37.08 48.13,37.08 v50.67,34.54
MOSI3  (via drill 0.61)
  Top 0.254: v53.72,16.13 54.23,16.13 55.88,17.78 55.88,20.07 54.74,21.21 47.88,21.21 47.24,21.84 46.1,21.84 45.78,21.52 45.3,21.52 IC10.4
  Top 0.305: X2.3 63.08,16.85 62.48,16.26 62.48,15.49 v61.85,14.86
  Bottom 0.305: v61.85,14.86 54.99,14.86 v53.72,16.13
N$1
  Top 0.305: IC3.4 16.65,25 17.02,24.64 17.02,22.61 16.26,21.84 15.62,21.84 15.37,21.59 10.54,21.59 10.29,21.34 6.48,21.34 4.57,19.43 L.A
N$2
  Top 0.254: U$1.L3 10.16,35.17 10.16,33.53 13.91,29.77 RN3.5
N$3
  Top 0.254: U$1.L1 3.3,32.14 3.3,33.02 5.59,35.31 8.38,35.31 9.53,34.16 9.53,33.15 13.7,28.98 RN3.6
N$4  (via drill 0.61)
  Top 0.254: 13.59,25.78 7.24,25.78 v6.22,26.8
  Top 0.305: IC2.13 49.53,37.98 47.37,40.13 47.37,45.85 44.96,48.26 41.66,48.26 J5.9 | IC3.2 13.72,25.65 13.59,25.78 | v5.59,47.62 5.59,46.61 1.78,42.8 1.78,40.89 v6.1,36.58 | v25.15,46.23 25.15,47.24 26.67,48.77 30.86,48.77 32.38,47.24 v32.77,47.24
  Bottom 0.254: v6.22,26.8 6.22,29.08 4.45,30.86 4.45,33.91 6.1,35.56 6.1,36.07
  Bottom 0.305: v5.59,47.62 8.51,50.55 11.3,50.55 13.53,48.32 19.75,48.32 21.97,46.23 v25.15,46.23 | 6.1,36.07 v6.1,36.58 | v32.77,47.24 32.64,47.24 31.88,48.01 31.88,49.02 32.26,49.4 33.27,49.4 33.66,49.02 37.34,49.02 J5.9
N$5
  Top 0.254: L.C 1.65,19.3 2.54,18.54 2.54,15.88 2.6,15.81 | RN1.7 2.14,15.35 2.6,15.81 | RN1.6 2.94,15.47 2.6,15.81
N$8
  Top 0.305: RN1.5 3.74,16.49 ON.A
N$9
  Top 0.254: TX.A 3.91,27.76 12.83,27.76 13.21,27.38 RN3.8
N$10
  Top 0.254: RN2.3 23.01,42.31 23.11,42.42 23.11,42.93 22.93,43.11 RN2.4 21.69,43.69 21.59,43.69 C2.2
N$13
  Top 0.305: J3.6 50.8,48.51 50.04,47.37 50.04,41.02 51.08,39.98 IC2.9
N$14
  Top 0.305: IC2.10 50.69,39.48 49.4,40.77 49.4,47.12 48.26,48.26 J3.7
N$15
  Top 0.305: 45.72,51.21 J3.8 45.72,49.66 48.72,46.66 48.72,40.64 50.38,38.98 IC2.11
N$16
  Top 0.305: J2.1 50.8,2.67 56.52,8.38 56.52,19.94 58.93,22.35 58.93,27.69 55.61,31.01 IC2.23
N$17
  Top 0.305: J2.2 53.34,3.94 57.15,7.75 57.15,19.81 59.5,22.16 59.5,28 56.11,31.4 IC2.24
N$18
  Top 0.305: J2.3 55.88,4.83 57.78,6.73 57.78,19.68 60.07,21.97 60.07,28.32 56.64,31.75 56.64,35.05 57.15,35.56 57.15,36.2 56.87,36.48 IC2.25
N$19
  Top 0.305: J2.4 58.17,2.79 58.17,4.83 58.42,5.08 58.42,19.56 60.64,21.78 60.64,28.64 57.15,32.13 57.15,34.67 57.66,35.18 57.66,36.58 57.26,36.98 IC2.26
N$22
  Top 0.254: 3.68,29.34 RX.A 4.73,28.32 13.34,28.32 13.44,28.18 RN3.7
N$29
  Top 0.254: RN2.2 23.01,41.51 23.11,41.4 23.11,40.89 22.93,40.71 RN2.1 22.1,40.64 21.08,39.88 20.95,39.88 20.61,39.54 C4.2
N$30
  Top 0.254: R3.2 R2.1
N$31
  Top 0.254: R3.1 22.86,35.05 24.26,35.05 30.04,29.27 30.1,29.27 30.1,27.69 29.46,27.05 29.46,25.4 29.47,25.39 IC6.1
N$32
  Bottom 0.406: R9.1 17.14,24.77 13.17,24.77 12.29,23.89 ZZ1.P$5
N$33
  Bottom 0.406: ZZ1.P$6 17.15,23.24 R9.2
N$34
  Top 0.406: R8.2 R10.1 49.91,25.33 ZZ1.P$9
N$36
  Top 0.254: 43.36,25.27 42.67,24.59 IC6.58 40.08,24.59 39.88,24.38 39.88,24.13 | 39.9,23.39 IC6.55 | 39.88,23.62 39.9,23.39 | 39.88,24.13 39.88,23.62 | 39.88,23.62 39.88,23.41 39.9,23.39 | IC6.57 39.94,24.19 39.88,24.13
  Top 0.305: 43.36,25.27 43.36,27.86 44.58,29.08 44.83,29.08 R12.1
OSC1E
  Top 0.254: IC6.76 33.61,30.69 R4.1
  Top 0.305: R4.1 C9.1
  Top 0.406: C9.1 32.51,33.66 32.13,34.04 Q2.1
OSC2E
  Top 0.254: IC6.75 34.01,29.82 35.18,30.99 R4.2
  Top 0.305: R4.2 C12.1
  Top 0.406: C12.1 37.59,32.89 38.35,33.66 39.5,33.66 Q2.2
PD0
  Top 0.305: IC2.30 57.65,38.98 58.42,39.75 60.33,39.75 61.47,38.61 J4.4
  Bottom 0.305: J3.1 63.5,47.62 64.26,46.86 64.26,40.26 62.61,38.61 J4.4
PD1
  Top 0.305: J3.2 60.96,49.53 63.63,46.86 63.63,39.88 | 63.63,39.88 61.21,39.88 60.58,40.51 58.29,40.51 57.26,39.48 IC2.31 | J4.5 61.98,36.2 63.63,37.85 63.63,39.88
PD2
  Top 0.305: IC2.32 56.87,39.98 57.91,41.02 57.91,50.29 J3.3
  Bottom 0.305: J3.3 58.42,49.53
PD3
  Top 0.305: J3.4 55.88,48.9 57.28,47.5 57.28,42.55 56.11,41.37 IC2.1
RESET  (via drill 0.61)
  Top 0.305: R1.1 47.75,29.72 47.75,32.92 IC1.3 46.23,32.24 v46.35,32.13 | v58.06,25.15 56.34,25.15 55.96,24.89 v54.23,24.89 54.23,26.54 53.59,27.18 52.45,27.18 52.2,27.43 50.04,27.43 R1.1 | IC2.29 58.17,38.48 59.18,37.47 v59.56,37.47 59.69,37.34 C23.1 | C3.1 47.37,27.81 48.13,28.57 R1.1 | POWER.3 v33.02,8.76
  Top 0.406: RESET2.1 RESET2.2 10.42,49.92 v10.41,49.4 | v59.56,37.47 59.44,38.43 D4.A
  Bottom 0.305: v58.06,25.15 63.37,25.15 63.63,25.4 ICSP.5 64.26,25.4 65.53,26.67 67.18,26.67 67.44,26.92 67.44,31.24 66.93,31.75 65.91,31.75 62.87,34.8 60.58,34.8 60.07,35.31 60.07,36.96 v59.56,37.47 | v10.41,49.4 10.67,49.15 11.3,49.15 12.76,47.69 19.49,47.69 23.88,43.31 23.88,39.62 25.91,37.59 41.78,37.59 45.09,34.29 45.09,33.27 v46.35,32.13 | v33.02,8.76 33.27,8.51 39.12,8.51 43.05,12.45 49.53,12.45 50.29,13.21 50.29,13.84 49.28,14.86 49.28,17.14 50.29,18.16 50.29,21.84 52.7,24.26 53.59,24.26 v54.23,24.89
RESET_W
  Top 0.254: IC6.59 42.39,24.99 42.75,25.35
  Top 0.305: 42.75,25.35 42.75,28.27 45.13,30.65 IC1.2
RTS
  Top 0.406: C23.2 60.71,34.8 J4.6
RXIN
  Top 0.254: RN2.7 19.2,41.51 18.54,42.16 18.54,43.94 17.14,45.34 14.86,45.34 13.97,44.45 13.97,43.86 U$1.R2 16.13,42.8 16.83,42.1 16.83,39.43 19.05,37.21 19.05,34.42 19.56,33.91 23.88,33.91 27.81,29.97 27.81,23.62 28.05,23.39 IC6.6
RXIP
  Top 0.254: RN2.8 18.98,40.71 17.97,41.72 17.97,43.5 17.4,44.07 U$1.R1 16,43.52 16.43,43.52 17.4,42.55 17.4,39.75 19.68,37.47 19.68,34.67 19.94,34.42 24.13,34.42 28.32,30.23 28.32,24.13 28.66,23.79 IC6.5
RXLED  (via drill 0.61)
  Top 0.254: v4.57,35.69 4.57,35.56 1.4,32.38 1.4,29.56 RX.C | IC6.72 35.21,28.48 35.47,28.74 36.1,28.74 v36.32,28.83
  Bottom 0.254: v36.32,28.83 34.29,28.83 34.04,29.08 30.73,29.08 21.34,38.48 21.34,42.04 17.97,45.4 13.14,45.4 4.57,36.83 v4.57,35.69
SCK  (via drill 0.61)
  Top 0.254: IC6.30 35.61,14.42 36.2,13.84 v36.2,13.72 | v49.15,13.59 48.51,12.95 IC11.2
  Top 0.305: IC2.17 52.61,34.19 52.83,33.91 v52.83,33.78 52.83,30.35 v52.96,30.23
  Bottom 0.229: 49.02,26.16 49.02,25.02
  Bottom 0.254: v36.2,13.72 36.83,14.35 36.83,18.92 44.45,26.54 46.1,26.54 49.91,29.34 50.16,29.85 | v49.15,13.59 48.13,14.61 48.13,21.84 49.02,22.73 49.02,25.02 | 50.16,29.85 50.29,30.61 51.18,31.5 | v52.96,30.23 52.96,30.73 52.2,31.5 52.07,31.5 | 50.16,29.85 50.16,29.84 | 49.02,26.16 50.27,27.41 50.27,29.87
  Bottom 0.305: J5.5 28.96,48.39 31.62,45.72 37.59,45.72 44.7,38.61 48.13,38.61 52.83,33.91 v52.83,33.78 | ICSP.3 61.72,27.94 61.21,28.45 55.12,28.45 53.34,30.23 v52.96,30.23 | 51.18,31.5 52.07,31.5
  Bottom 0.406: 49.91,29.34 50.27,29.87
SCK3  (via drill 0.61)
  Top 0.254: v54.1,13.97 53.59,14.48 52.83,14.48 52.58,14.73 50.16,14.73 49.78,15.11 45.59,15.11 45,14.52 IC11.4
  Top 0.305: X2.5 63.16,14.65 v61.72,13.21
  Bottom 0.305: v54.1,13.97 60.96,13.97 v61.72,13.21
SD_CS  (via drill 0.61)
  Top 0.254: v49.28,18.54 48.77,18.03 48.77,17.53 48.26,17.02 IC12.2
  Top 0.305: J3.5 53.34,49.53 54.61,48.26 55.5,48.26 56.64,47.12 56.64,42.8 55.61,41.76 IC2.2 | v51.69,30.61 49.53,30.61 49.15,30.99 49.15,35.94 46.1,38.99 46.1,44.83 v45.47,45.47
  Bottom 0.305: v49.28,18.54 49.28,21.97 51.56,24.26 51.56,30.35 51.69,30.48 v51.69,30.61 | v45.47,45.47 48.9,45.47 53.34,49.91 J3.5
SEN
  Top 0.254: IC6.31 36.01,14.91 36.32,14.61 36.83,14.61 37.21,14.22 37.21,13.34 36.58,12.7 35.56,12.7 35.31,12.95 32,12.95 30.99,13.97 28.45,13.97 27.94,14.48 27.94,15.49 27.15,16.29 27.05,16.29 IC13.4
SEN3  (via drill 0.61)
  Top 0.254: v54.86,18.03 54.86,18.29 53.59,19.56 48.64,19.56 47.75,18.67 46.61,18.67 45.61,17.67 IC12.4
  Top 0.305: X2.2 62.65,17.95 v61.47,16.89
  Bottom 0.305: v61.47,16.89 56.01,16.89 v54.86,18.03
SPDLED  (via drill 0.61)
  Top 0.254: IC6.67 37.21,28.58 37.97,29.34 41.27,29.34 43.43,31.5 v43.43,32
  Bottom 0.254: v43.43,32 43.43,34.16 41.27,36.32 25.27,36.32 22.61,38.99 22.61,42.55 18.61,46.55 12.64,46.55 1.78,35.69 1.78,34.67
  Bottom 0.305: U$1.L2 1.78,34.67
SS  (via drill 0.61)
  Top 0.254: IC6.29 35.21,14.39 v34.8,13.97 31.75,13.97 29.97,15.75 IC13.2
  Top 0.305: J5.8 36.58,50.42 37.85,49.15 39.88,49.15 41.4,47.62 44.7,47.62 46.74,45.47 46.74,39.57 49.91,36.4 | 49.88,36.32 49.78,36.32 49.78,31.88 v50.04,31.62 | 49.88,36.32 49.91,36.32 | 49.88,36.32 49.89,37.16 50.21,37.48 IC2.14 | R11.2 24.38,18.8 24.77,18.41 25.4,18.41 26.16,17.65 27.18,17.65 27.69,17.14 27.69,16.51 28.45,15.75 IC13.2
  Top 0.61: 49.91,36.32 49.91,36.4
  Bottom 0.254: v50.04,31.62 49.53,31.62 49.28,31.37 49.28,29.59 45.97,27.18 44.32,27.18 36.18,19.04 36.18,15.35 v34.8,13.97
SW
  pour Top (isolate 0.406, no thermals): 17.91,7.24 22.1,7.24 22.1,8.26 30.99,8.26 30.99,11.18 29.97,12.19 20.83,12.19 20.83,10.67 19.3,10.67 19.3,8.13 17.91,8.13
TXLED  (via drill 0.61)
  Top 0.254: v35.18,29.72 34.8,29.34 34.8,27.21 IC6.73 | TX.C 1.49,24.35 v1.4,24.13
  Bottom 0.254: v35.18,29.72 31.11,29.72 21.97,38.73 21.97,42.29 18.29,45.97 12.89,45.97 2.92,36.01 2.92,33.78 1.14,32 1.14,24.38 v1.4,24.13
TXON
  Top 0.254: IC6.9 27.09,22.19 26.8,22.48 26.8,29.46 23.37,32.89 18.8,32.89 17.78,33.91 17.78,36.58 16.64,37.72 14.61,37.72 14.22,38.1 14.22,38.95 U$1.R4 12.32,40.26 11.18,41.4 11.18,43.69 14.1,46.61 17.91,46.61 19.68,44.83 19.68,43.56 20.14,43.11 RN2.5
TXOP
  Top 0.254: IC6.8 27.69,22.59 27.3,22.97 27.3,29.72 23.62,33.4 19.18,33.4 18.41,34.16 18.41,36.96 16.51,38.86 15.58,38.86 U$1.R5 14.48,39.96 14.48,40.64 13.59,41.53 12.06,41.53 11.68,41.91 11.68,43.43 12.45,44.2 12.7,44.2 14.48,45.97 17.53,45.97 19.11,44.39 19.11,42.61 19.41,42.31 RN2.6
V1+
  Bottom 0.508: ZZ1.P$1 2.16,22.73 4.45,25.02 6.73,25.02 12.91,31.2 U$1.R10
V1-
  Bottom 0.508: ZZ1.P$2 4.69,22.73 6.1,24.13 7.24,24.13 15.37,32.26 15.37,33.82 U$1.R9
V2+
  Bottom 0.508: U$1.R7 17.02,36.45 17.65,35.81 17.65,31.62 10.79,24.77 10.79,23.92 ZZ1.P$4
V2-
  Bottom 0.406: 16.13,35.18 U$1.R8
  Bottom 0.508: 16.13,35.18 16.76,34.54 16.76,32.26 7.87,23.37 7.75,23.37 7.23,22.84 ZZ1.P$3
VIN  (via drill 0.61)
  Top 0.406: C15.2 R8.1 46.86,24.64 ZZ1.P$8
  Top 0.61: R5.1 15.93,4.95 16.23,4.67 C11.+ 17.14,4.8 IC5.5
  Top 0.813: v10.16,12.7 10.16,10.79 11.68,8.89 X1.2 13.97,6.02 13.97,5.59 14.48,5.21 14.73,5.21 R5.1 | POWER.8 45.72,5.97 42.55,9.14 40.02,9.14 C14.+ v40.15,11.43 | D1.C 13.61,20.07 IC4.3 11.51,19.96 v11.43,20.04
  Bottom 0.813: 40.13,11.43 38.1,9.4 34.16,9.4 33.4,10.16 31.62,10.16 30.99,10.79 30.99,13.84 29.34,15.49 25.15,15.49 20.19,20.32 11.71,20.32 v11.43,20.04 11.43,14.86 10.16,13.46 v10.16,12.7
  Bottom 1.27: v40.15,11.43 40.13,11.43 40.64,11.68 42.67,13.72 46.35,13.72 46.99,14.35 46.99,22.86 47.77,23.64 ZZ1.P$8
WOL/IO
  Top 0.305: IC2.12 50.04,38.48 48.01,40.51 48.01,46.23 45.34,48.9 42.8,48.9 41.66,50.04 J5.10
XTAL1
  Top 0.305: IC2.7 53.11,40.87 53.09,40.89 53.09,42.42 53.32,42.66 Y1.3
XTAL2
  Top 0.305: 51.43,44.98 Y1.1 51.31,45.07 51.31,41.78 52.61,40.48 IC2.8

### Text on the board
Top: LC
Bottom: ETH 8D - Rev 3 | LS | in Italy | Made
tPlace: S P I | DIGITAL | BLK | LINK | Ethernet-V8c | 100M
tNames: M.Banzi | D.Cuartielles | T.Igoe | G.Martino | 3 2 1 0 9 8 | GND | 7 6 5 4 3 2 1 0 | TX | D.Mellis | AREF | 1 1 1 1 | * | * | * | * | * | * | (*=PWM) | RX | TM | Arduino | www.arduino.cc | 1 | ANALOG IN | IOREF | RES | 3V3 | 5V Gnd 12V | 0 1 2 3 4 5